# Altium project PPG_sensor.PrjPcb
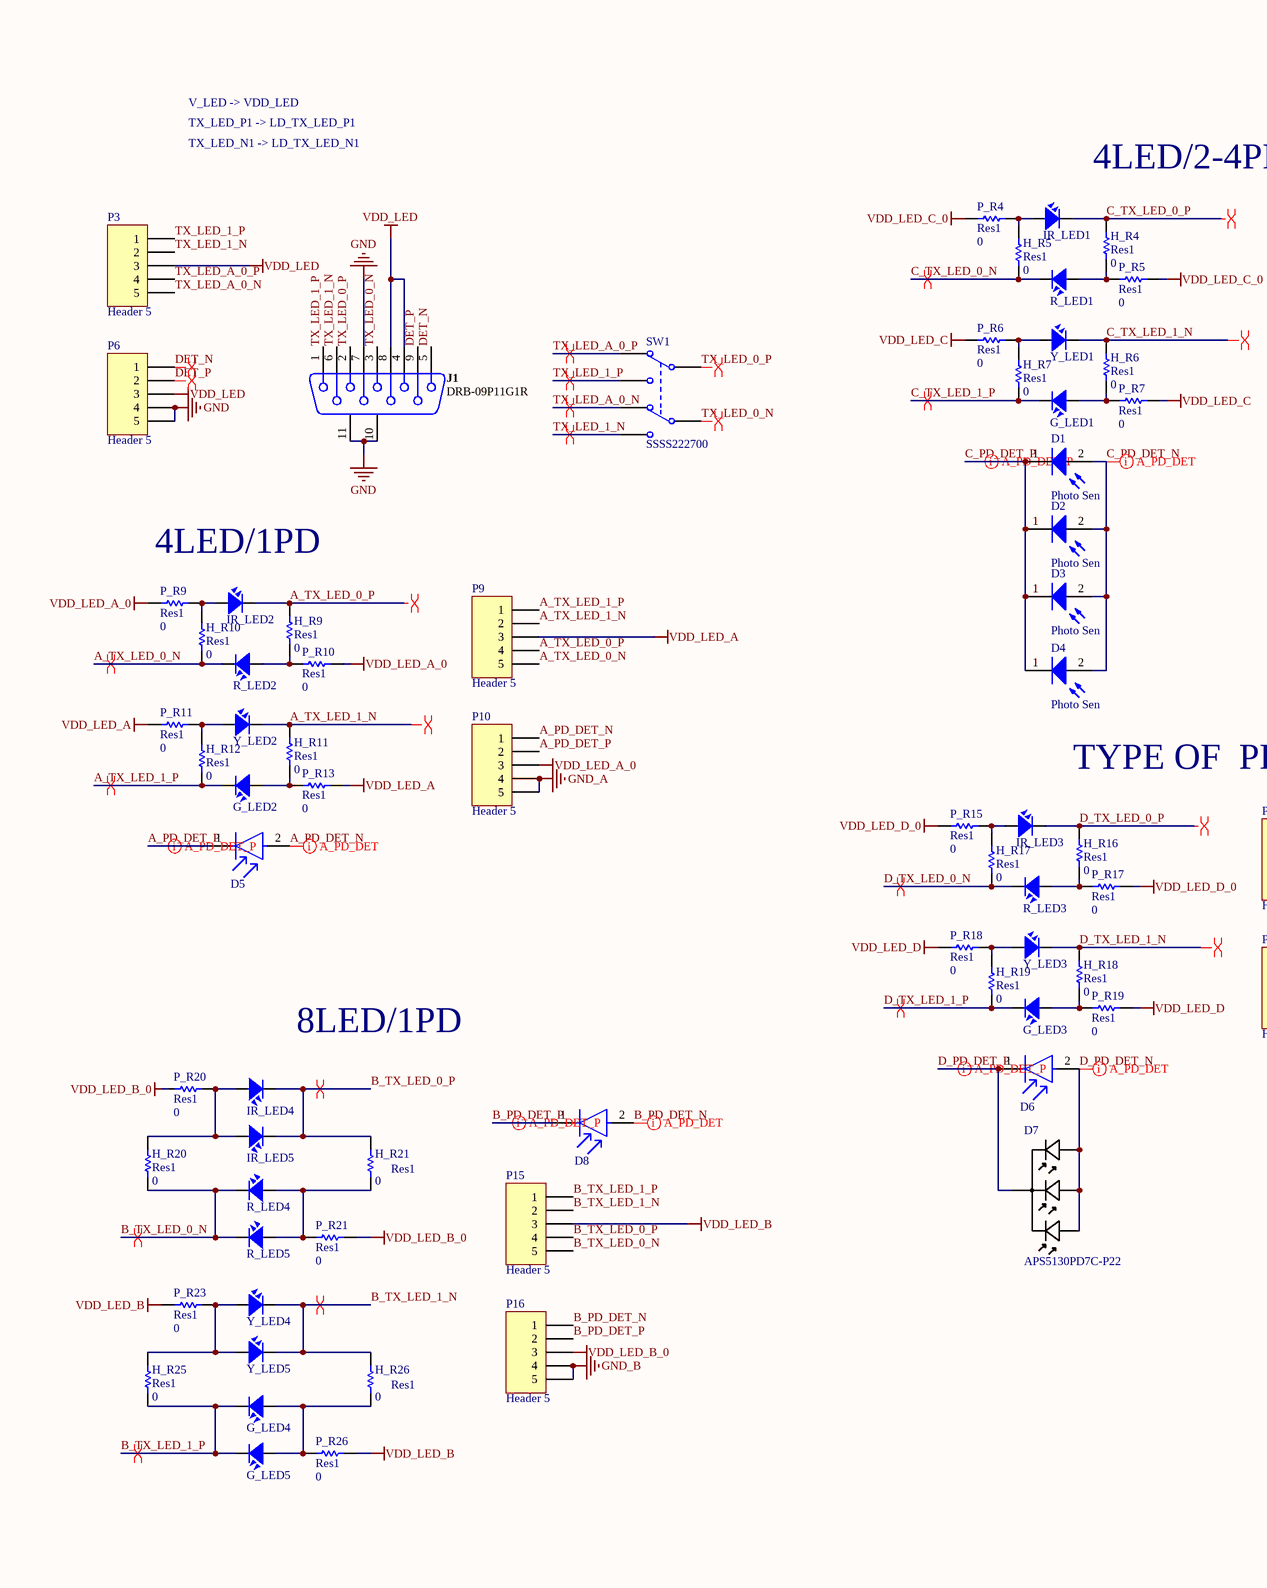
[diagram p0: PPG_sensor.SchDoc, left]
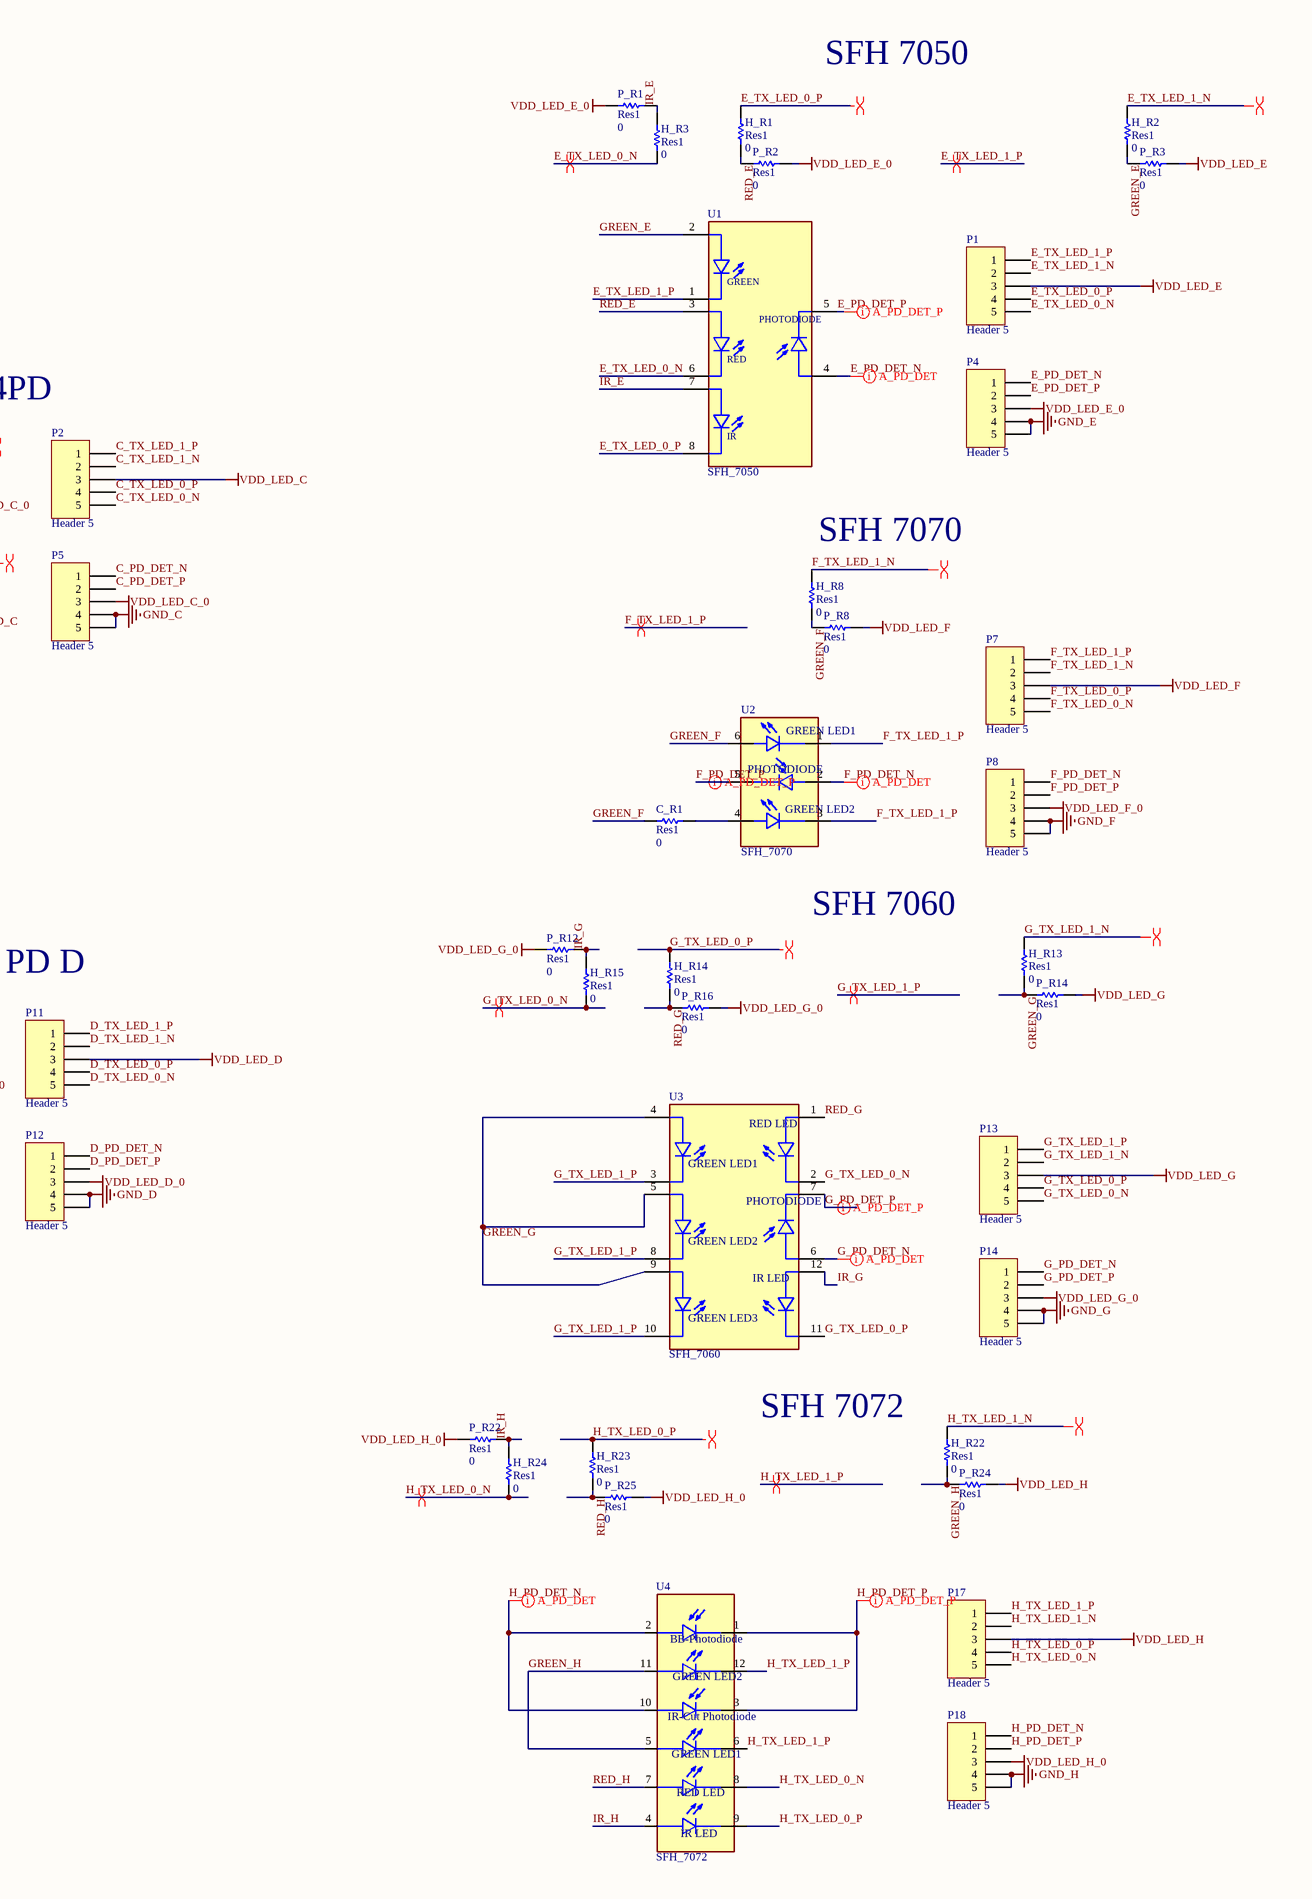
[diagram p1: PPG_sensor.SchDoc, right]
1 sheet, 105 parts. Net scope: global (net labels, ports and power ports of the same name join across sheets).
Board file: PPG_sensor.PcbDoc

## Sheet PPG_sensor.SchDoc
size C

### Parts
C_R1  Res1  value 0  [RES-SMD-0603]
D1  Photo Sen  [PD_2704]
D2  Photo Sen  [PD_2704]
D3  Photo Sen  [PD_2704]
D4  Photo Sen  [PD_2704]
D5  SFH_2704  [OSRAM_Opto_Semiconductors_SFH_2704_MFG]  (value not drawn)
D6  SFH_2704  [OSRAM_Opto_Semiconductors_SFH_2704_MFG]  (value not drawn)
D7  APS5130PD7C-P22  [LED_APS5130PD7C-P22_KNB]
D8  SFH_2704  [OSRAM_Opto_Semiconductors_SFH_2704_MFG]  (value not drawn)
G_LED1  LED  [RESC0402X15N]  (value not drawn)
G_LED2  LED  [LED_PPG_DISTANCE_2]  (value not drawn)
G_LED3  LED  [LED_PPG_DISTANCE_2]  (value not drawn)
G_LED4  LED  [LED_PPG_DISTANCE_2]  (value not drawn)
G_LED5  LED  [LED_PPG_DISTANCE_2]  (value not drawn)
H_R1  Res1  value 0  [RES-SMD-0603]
H_R2  Res1  value 0  [RES-SMD-0603]
H_R3  Res1  value 0  [RES-SMD-0603]
H_R4  Res1  value 0  [RES-SMD-0603]
H_R5  Res1  value 0  [RES-SMD-0603]
H_R6  Res1  value 0  [RES-SMD-0603]
H_R7  Res1  value 0  [RES-SMD-0603]
H_R8  Res1  value 0  [RES-SMD-0603]
H_R9  Res1  value 0  [RES-SMD-0603]
H_R10  Res1  value 0  [RES-SMD-0603]
H_R11  Res1  value 0  [RES-SMD-0603]
H_R12  Res1  value 0  [RES-SMD-0603]
H_R13  Res1  value 0  [RES-SMD-0603]
H_R14  Res1  value 0  [RES-SMD-0603]
H_R15  Res1  value 0  [RES-SMD-0603]
H_R16  Res1  value 0  [RES-SMD-0603]
H_R17  Res1  value 0  [RES-SMD-0603]
H_R18  Res1  value 0  [RES-SMD-0603]
H_R19  Res1  value 0  [RES-SMD-0603]
H_R20  Res1  value 0  [RES-SMD-0603]
H_R21  Res1  value 0  [RES-SMD-0603]
H_R22  Res1  value 0  [RES-SMD-0603]
H_R23  Res1  value 0  [RES-SMD-0603]
H_R24  Res1  value 0  [RES-SMD-0603]
H_R25  Res1  value 0  [RES-SMD-0603]
H_R26  Res1  value 0  [RES-SMD-0603]
IR_LED1  LED  [RESC0402X15N]  (value not drawn)
IR_LED2  LED  [LED_PPG_DISTANCE_2]  (value not drawn)
IR_LED3  LED  [LED_PPG_DISTANCE_2]  (value not drawn)
IR_LED4  LED  [LED_PPG_DISTANCE_2]  (value not drawn)
IR_LED5  LED  [LED_PPG_DISTANCE_2]  (value not drawn)
J1  DRB-09P11G1R  [K202XHT-E9P-NJ_DB9_Male]
P1  Header 5  [HDR 5 POS 1 ROW]
P2  Header 5  [HDR 5 POS 1 ROW]
P3  Header 5  [HDR1X5]
P4  Header 5  [HDR 5 POS 1 ROW]
P5  Header 5  [HDR 5 POS 1 ROW]
P6  Header 5  [HDR1X5]
P7  Header 5  [HDR 5 POS 1 ROW]
P8  Header 5  [HDR 5 POS 1 ROW]
P9  Header 5  [HDR 5 POS 1 ROW]
P10  Header 5  [HDR 5 POS 1 ROW]
P11  Header 5  [HDR 5 POS 1 ROW]
P12  Header 5  [HDR 5 POS 1 ROW]
P13  Header 5  [HDR 5 POS 1 ROW]
P14  Header 5  [HDR 5 POS 1 ROW]
P15  Header 5  [HDR 5 POS 1 ROW]
P16  Header 5  [HDR 5 POS 1 ROW]
P17  Header 5  [HDR 5 POS 1 ROW]
P18  Header 5  [HDR 5 POS 1 ROW]
P_R1  Res1  value 0  [RES-SMD-0603]
P_R2  Res1  value 0  [RES-SMD-0603]
P_R3  Res1  value 0  [RES-SMD-0603]
P_R4  Res1  value 0  [RES-SMD-0603]
P_R5  Res1  value 0  [RES-SMD-0603]
P_R6  Res1  value 0  [RES-SMD-0603]
P_R7  Res1  value 0  [RES-SMD-0603]
P_R8  Res1  value 0  [RES-SMD-0603]
P_R9  Res1  value 0  [RES-SMD-0603]
P_R10  Res1  value 0  [RES-SMD-0603]
P_R11  Res1  value 0  [RES-SMD-0603]
P_R12  Res1  value 0  [RES-SMD-0603]
P_R13  Res1  value 0  [RES-SMD-0603]
P_R14  Res1  value 0  [RES-SMD-0603]
P_R15  Res1  value 0  [RES-SMD-0603]
P_R16  Res1  value 0  [RES-SMD-0603]
P_R17  Res1  value 0  [RES-SMD-0603]
P_R18  Res1  value 0  [RES-SMD-0603]
P_R19  Res1  value 0  [RES-SMD-0603]
P_R20  Res1  value 0  [RES-SMD-0603]
P_R21  Res1  value 0  [RES-SMD-0603]
P_R22  Res1  value 0  [RES-SMD-0603]
P_R23  Res1  value 0  [RES-SMD-0603]
P_R24  Res1  value 0  [RES-SMD-0603]
P_R25  Res1  value 0  [RES-SMD-0603]
P_R26  Res1  value 0  [RES-SMD-0603]
R_LED1  LED  [RESC0402X15N]  (value not drawn)
R_LED2  LED  [LED_PPG_DISTANCE_2]  (value not drawn)
R_LED3  LED  [LED_PPG_DISTANCE_2]  (value not drawn)
R_LED4  LED  [LED_PPG_DISTANCE_2]  (value not drawn)
R_LED5  LED  [LED_PPG_DISTANCE_2]  (value not drawn)
SW1  SSSS222700  [DPDT_SSSS222700]
U1  SFH_7050  [XDCR_SFH_7050]
U2  SFH_7070  [XDCR_SFH_7070]
U3  SFH_7060  [XDCR_SFH_7060]
U4  SFH_7072  [XDCR_SFH_7072]
Y_LED1  LED  [RESC0402X15N]  (value not drawn)
Y_LED2  LED  [LED_PPG_DISTANCE_2]  (value not drawn)
Y_LED3  LED  [LED_PPG_DISTANCE_2]  (value not drawn)
Y_LED4  LED  [LED_PPG_DISTANCE_2]  (value not drawn)
Y_LED5  LED  [LED_PPG_DISTANCE_2]  (value not drawn)

### Nets
GND: J1.7 J1.10(MH1) J1.11(MH2) P6.4 P6.5
GND_A: P10.4 P10.5
GND_B: P16.4 P16.5
GND_C: P5.4 P5.5
GND_D: P12.4 P12.5
GND_E: P4.4 P4.5
GND_F: P8.4 P8.5
GND_G: P14.4 P14.5
GND_H: P18.4 P18.5
VDD_LED: J1.4 J1.8 P3.3 P6.3
VDD_LED_A: P9.3 P_R11.2 P_R13.2
VDD_LED_A_0: P10.3 P_R9.2 P_R10.2
VDD_LED_B: P15.3 P_R23.1 P_R26.2
VDD_LED_B_0: P16.3 P_R20.1 P_R21.2
VDD_LED_C: P2.3 P_R6.2 P_R7.2
VDD_LED_C_0: P5.3 P_R4.2 P_R5.2
VDD_LED_D: P11.3 P_R18.2 P_R19.2
VDD_LED_D_0: P12.3 P_R15.2 P_R17.2
VDD_LED_E: P1.3 P_R3.2
VDD_LED_E_0: P4.3 P_R1.2 P_R2.2
VDD_LED_F: P7.3 P_R8.2
VDD_LED_F_0: P8.3
VDD_LED_G: P13.3 P_R14.2
VDD_LED_G_0: P14.3 P_R12.2 P_R16.2
VDD_LED_H: P17.3 P_R24.2
VDD_LED_H_0: P18.3 P_R22.2 P_R25.2
A_PD_DET_N: D5.2(A) P10.1
A_PD_DET_P: D5.1(C) P10.2
A_TX_LED_0_N: H_R10.2 P9.5 R_LED2.2
A_TX_LED_0_P: H_R9.1 IR_LED2.2 P9.4
A_TX_LED_1_N: H_R11.1 P9.2 Y_LED2.2
A_TX_LED_1_P: G_LED2.2 H_R12.2 P9.1
B_PD_DET_N: D8.2(A) P16.1
B_PD_DET_P: D8.1(C) P16.2
B_TX_LED_0_N: H_R20.2 P15.5 R_LED4.2 R_LED5.2
B_TX_LED_0_P: H_R21.1 IR_LED4.2 IR_LED5.2 P15.4
B_TX_LED_1_N: H_R26.1 P15.2 Y_LED4.2 Y_LED5.2
B_TX_LED_1_P: G_LED4.2 G_LED5.2 H_R25.2 P15.1
C_PD_DET_N: D1.2(A) D2.2(A) D3.2(A) D4.2(A) P5.1
C_PD_DET_P: D1.1(K) D2.1(K) D3.1(K) D4.1(K) P5.2
C_TX_LED_0_N: H_R5.2 P2.5 R_LED1.2
C_TX_LED_0_P: H_R4.1 IR_LED1.2 P2.4
C_TX_LED_1_N: H_R6.1 P2.2 Y_LED1.2
C_TX_LED_1_P: G_LED1.2 H_R7.2 P2.1
D_PD_DET_N: D6.2(A) D7.1 D7.2 D7.3 P12.1
D_PD_DET_P: D6.1(C) D7.4 P12.2
D_TX_LED_0_N: H_R17.2 P11.5 R_LED3.2
D_TX_LED_0_P: H_R16.1 IR_LED3.2 P11.4
D_TX_LED_1_N: H_R18.1 P11.2 Y_LED3.2
D_TX_LED_1_P: G_LED3.2 H_R19.2 P11.1
DET_N: J1.5 P6.1
DET_P: J1.9 P6.2
E_PD_DET_N: P4.1 U1.4(PA)
E_PD_DET_P: P4.2 U1.5(PC)
E_TX_LED_0_N: H_R3.2 P1.5 U1.6(RC)
E_TX_LED_0_P: H_R1.1 P1.4 U1.8(IC)
E_TX_LED_1_N: H_R2.1 P1.2
E_TX_LED_1_P: P1.1 U1.1(GC)
F_PD_DET_N: P8.1 U2.2(PA)
F_PD_DET_P: P8.2 U2.5(PC)
F_TX_LED_0_N: P7.5
F_TX_LED_0_P: P7.4
F_TX_LED_1_N: H_R8.1 P7.2
F_TX_LED_1_P: P7.1 U2.1(G1C) U2.3(G2C)
G_PD_DET_N: P14.1 U3.6(PA)
G_PD_DET_P: P14.2 U3.7(PC)
G_TX_LED_0_N: H_R15.2 P13.5 U3.2(RC)
G_TX_LED_0_P: H_R14.1 P13.4 U3.11(IC)
G_TX_LED_1_N: H_R13.1 P13.2
G_TX_LED_1_P: P13.1 U3.3(G1C) U3.8(G2C) U3.10(G3C)
GREEN_E: H_R2.2 P_R3.1 U1.2(GA)
GREEN_F: C_R1.1 H_R8.2 P_R8.1 U2.6(G1A)
GREEN_G: H_R13.2 P_R14.1 U3.4(G1A) U3.5(G2A) U3.9(G3A)
GREEN_H: H_R22.2 P_R24.1 U4.5(G1A) U4.11(G2A)
H_PD_DET_N: P18.1 U4.2(BPA) U4.10(IPA)
H_PD_DET_P: P18.2 U4.1(BPC) U4.3(IPC)
H_TX_LED_0_N: H_R24.2 P17.5 U4.8(RC)
H_TX_LED_0_P: H_R23.1 P17.4 U4.9(IC)
H_TX_LED_1_N: H_R22.1 P17.2
H_TX_LED_1_P: P17.1 U4.6(G1C) U4.12(G2C)
IR_E: H_R3.1 P_R1.1 U1.7(IA)
IR_G: H_R15.1 P_R12.1 U3.12(IA)
IR_H: H_R24.1 P_R22.1 U4.4(IA)
RED_E: H_R1.2 P_R2.1 U1.3(RA)
RED_G: H_R14.2 P_R16.1 U3.1(RA)
RED_H: H_R23.2 P_R25.1 U4.7(RA)
TX_LED_0_N: J1.3 SW1.5(COMMON2)
TX_LED_0_P: J1.2 SW1.2(COMMON1)
TX_LED_1_N: J1.6 P3.2 SW1.6(NO2)
TX_LED_1_P: J1.1 P3.1 SW1.3(NO1)
TX_LED_A_0_N: P3.5 SW1.4(NC2)
TX_LED_A_0_P: P3.4 SW1.1(NC1)
NetC_R1_2: C_R1.2 U2.4(G2A)
NetG_LED1_1: G_LED1.1 H_R6.2 P_R7.1
NetG_LED2_1: G_LED2.1 H_R11.2 P_R13.1
NetG_LED3_1: G_LED3.1 H_R18.2 P_R19.1
NetG_LED4_1: G_LED4.1 G_LED5.1 H_R26.2 P_R26.1
NetH_R4_2: H_R4.2 P_R5.1 R_LED1.1
NetH_R5_1: H_R5.1 IR_LED1.1 P_R4.1
NetH_R7_1: H_R7.1 P_R6.1 Y_LED1.1
NetH_R9_2: H_R9.2 P_R10.1 R_LED2.1
NetH_R10_1: H_R10.1 IR_LED2.1 P_R9.1
NetH_R12_1: H_R12.1 P_R11.1 Y_LED2.1
NetH_R16_2: H_R16.2 P_R17.1 R_LED3.1
NetH_R17_1: H_R17.1 IR_LED3.1 P_R15.1
NetH_R19_1: H_R19.1 P_R18.1 Y_LED3.1
NetH_R20_1: H_R20.1 IR_LED4.1 IR_LED5.1 P_R20.2
NetH_R21_2: H_R21.2 P_R21.1 R_LED4.1 R_LED5.1
NetH_R25_1: H_R25.1 P_R23.2 Y_LED4.1 Y_LED5.1

### Layout directives
differential pair; rule Differential Pairs Routing [Pref Gap = 0.6mm    Min Gap  = 0.3mm    Max Gap  = 0.8mmPref Width = 0.6mm    Min Width  = 0.381mm    Max Width  = 0.8mm]: A_PD_DET_P, B_PD_DET_P, C_PD_DET_P, D_PD_DET_P, E_PD_DET_P, F_PD_DET_P, G_PD_DET_P, H_PD_DET_P
differential pair; rule Differential Pairs Routing [Pref Gap = 0.6mm    Min Gap  = 0.3mm    Max Gap  = 0.8mmPref Width = 0.6mm    Min Width  = 0.4mm    Max Width  = 0.8mm]: A_PD_DET_N, B_PD_DET_N, C_PD_DET_N, D_PD_DET_N, E_PD_DET_N, F_PD_DET_N, G_PD_DET_N, H_PD_DET_N
differential pair: A_TX_LED_0_N, A_TX_LED_0_P, A_TX_LED_1_N, A_TX_LED_1_P, B_TX_LED_0_N, B_TX_LED_0_P, B_TX_LED_1_N, B_TX_LED_1_P, C_TX_LED_0_N, C_TX_LED_0_P, C_TX_LED_1_N, C_TX_LED_1_P, D_TX_LED_0_N, D_TX_LED_0_P, D_TX_LED_1_N, D_TX_LED_1_P, DET_N, DET_P, E_TX_LED_0_N, E_TX_LED_0_P, E_TX_LED_1_N, E_TX_LED_1_P, F_TX_LED_1_N, F_TX_LED_1_P, G_TX_LED_0_N, G_TX_LED_0_P, G_TX_LED_1_N, G_TX_LED_1_P, H_TX_LED_0_N, H_TX_LED_0_P, H_TX_LED_1_N, H_TX_LED_1_P, TX_LED_0_N, TX_LED_0_P, TX_LED_1_N, TX_LED_1_P, TX_LED_A_0_N, TX_LED_A_0_P

### Notes on the sheet
- SFH 7050
- V_LED -> VDD_LED
- TX_LED_P1 -> LD_TX_LED_P1
- TX_LED_N1 -> LD_TX_LED_N1
- 4LED/2-4PD
- (near H_R8) SFH 7070
- 4LED/1PD
- SFH 7060
- TYPE OF  PD D
- 8LED/1PD
- SFH 7072
- (in symbol SFH_7050) GREEN; PHOTODIODE; RED; IR
- (in symbol SFH_7060) RED LED; GREEN LED1; PHOTODIODE; GREEN LED2; IR LED; GREEN LED3
- (in symbol SFH_7070) GREEN LED1; PHOTODIODE; GREEN LED2
- (in symbol SFH_7072) BB-Photodiode; GREEN LED2; IR-Cut Photodiode; GREEN LED1; RED LED; IR LED

### Library data of the parts
C_R1 H_R1-H_R26 P_R1-P_R26 = Res1: Resistor; Published: 8-Jun-2000; LatestRevisionDate: 17-Jul-2002; LatestRevisionNote: Re-released for DXP Platform.; PackageReference: AXIAL-0.3; Publisher: Altium Limited; PackageDescription: Axial Device, Thru-Hole; 2 Leads; 0.3 in Pin Spacing
D1-D4 = Photo Sen: Photosensitive Diode; Published: 24-Mar-1999; LatestRevisionDate: 17-Jul-2002; LatestRevisionNote: Re-released for DXP Platform.; PackageReference: PIN2; Publisher: Altium Limited
D7 = APS5130PD7C-P22: No Description Available; Mfr_Name: Kingbright; Type: DEV; Copyright: Copyright (C) 2021 Ultra Librarian. All rights reserved.; Manufacturer_Part_Number: APS5130PD7C-P22; Digi-Key_Part_Number_1: 754-2215-2-ND; Digi-Key_Part_Number_2: 754-2215-1-ND; Digi-Key_Part_Number_3: 754-2215-6-ND; RefDes: RefDes
G_LED1-G_LED5 IR_LED1-IR_LED5 R_LED1-R_LED5 Y_LED1-Y_LED5 = LED SMD: Value: LED 3 - 5 ly 2 Colour
J1 = CON 9 Male: Connector, DB9 R/A Through-hole Male; Connector type: Header; Max Current: 3A; Mounting Technology: Through-Hole; Pin Count: 9; Status: Unreleased; Category: Connector
P1-P18 = Header 5: Header, 5-Pin; LatestRevisionDate: 17-Jul-2002; LatestRevisionNote: Re-released for DXP Platform.; Publisher: Altium Limited
U1 = SFH_7050: Salida de voltaje del sensor de oxÃ­metro / frecuencia cardÃ­aca; MF: OSRAM Opto; Digi-Key_Part_Number: 475-3346-1-ND; Digi-Key_Purchase_URL: https://www.digikey.com/product-detail/en/osram-opto-semiconductors-inc/SFH-7050/475-3346-1-ND/7645273?utm_source=snapeda&utm_medium=aggregator&utm_campaign=symbol; Package: None; MP: SFH 7050; Value: *; SnapEDA_Link: https://www.snapeda.com/parts/SFH%207050/OSRAM%20Opto%20Semiconductors%20Inc./view-part/227176/?ref=snap
U2 = SFH_7070: Reflective Optical Sensor 6-SMD, No Lead; MF: OSRAM Opto; Availability: Unavailable; Price: None; Package: SMD-6 Osram Opto; MP: SFH 7070; Value: *; SnapEDA_Link: https://www.snapeda.com/parts/SFH%207070/OSRAM%20Opto%20Semiconductors%20Inc./view-part/1043339/?ref=snap
U3 = SFH_7060: Oximeter/Heart Rate Sensor Current Output; MF: OSRAM Opto; MP: SFH 7060; SnapEDA_Link: https://www.snapeda.com/parts/SFH%207060/OSRAM%20Opto%20Semiconductors%20Inc./view-part/448279/?ref=snap; Price: None; Package: None; Availability: Unavailable; Value: *
U4 = SFH_7072: Reflective Optical Sensor 6-SMD, No Lead; MF: OSRAM Opto; Price: None; Availability: Unavailable; Value: *; MP: SFH 7072; SnapEDA_Link: https://www.snapeda.com/parts/SFH%207072/OSRAM%20Opto%20Semiconductors%20Inc./view-part/2464223/?ref=snap; Package: SMD-6 Osram Opto